# Altium project 11-10042__bug-brain__A.PrjPcb
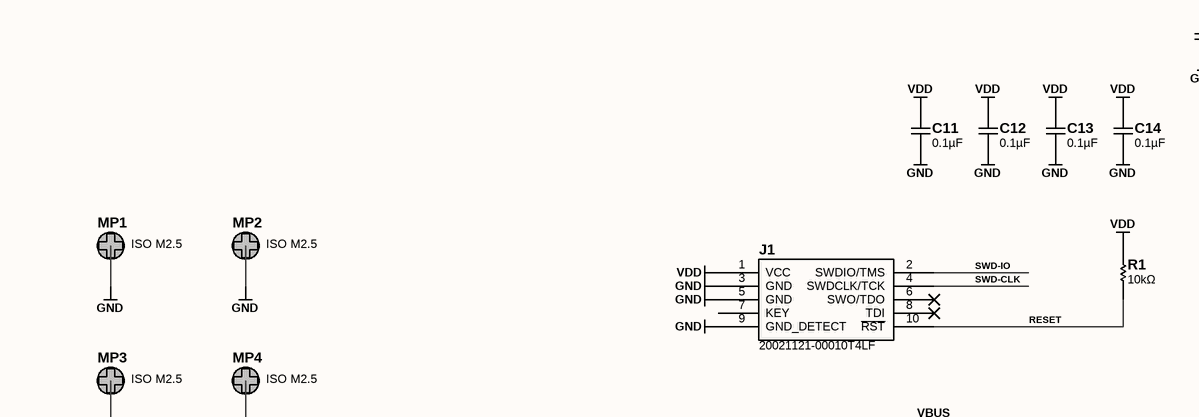
[diagram p0: bug-brain__TOP_LEVEL__A.SchDoc, top left]
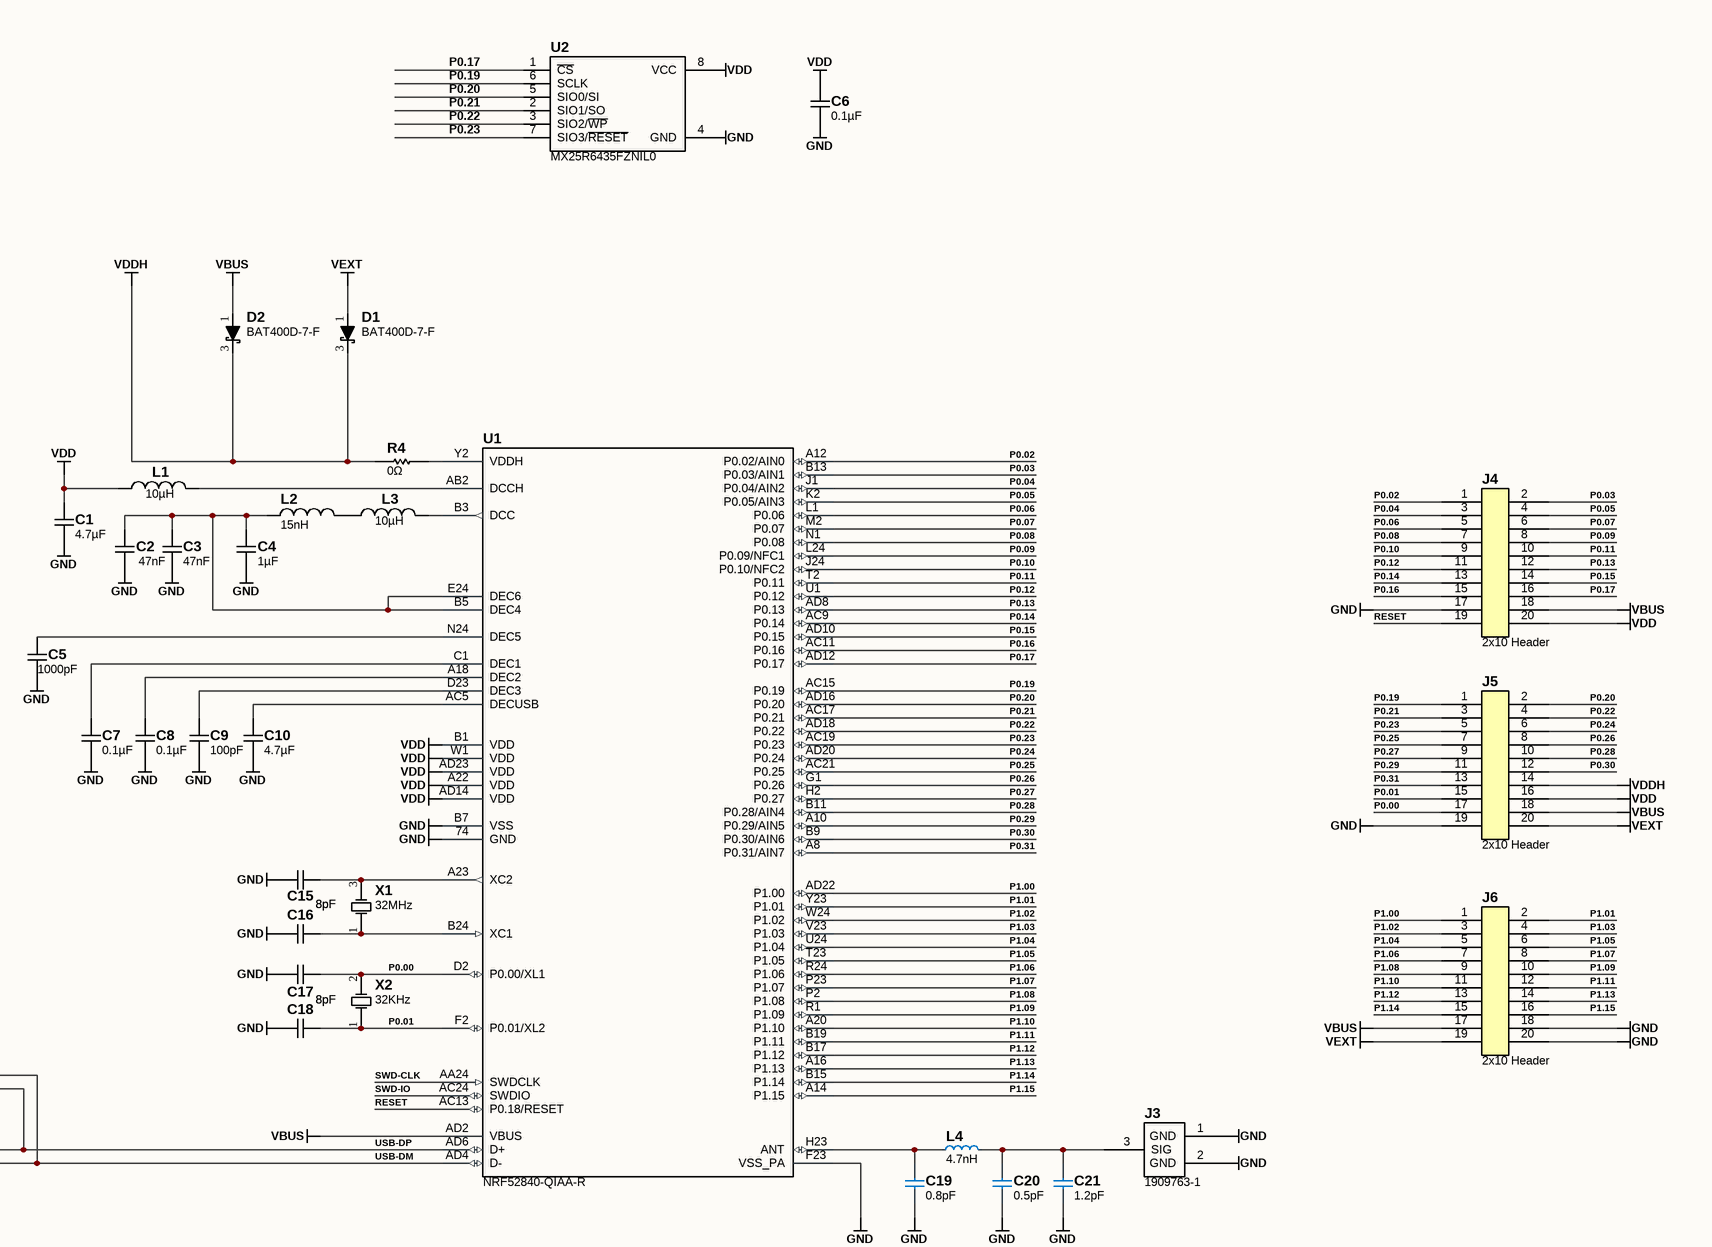
[diagram p1: bug-brain__TOP_LEVEL__A.SchDoc, top right]
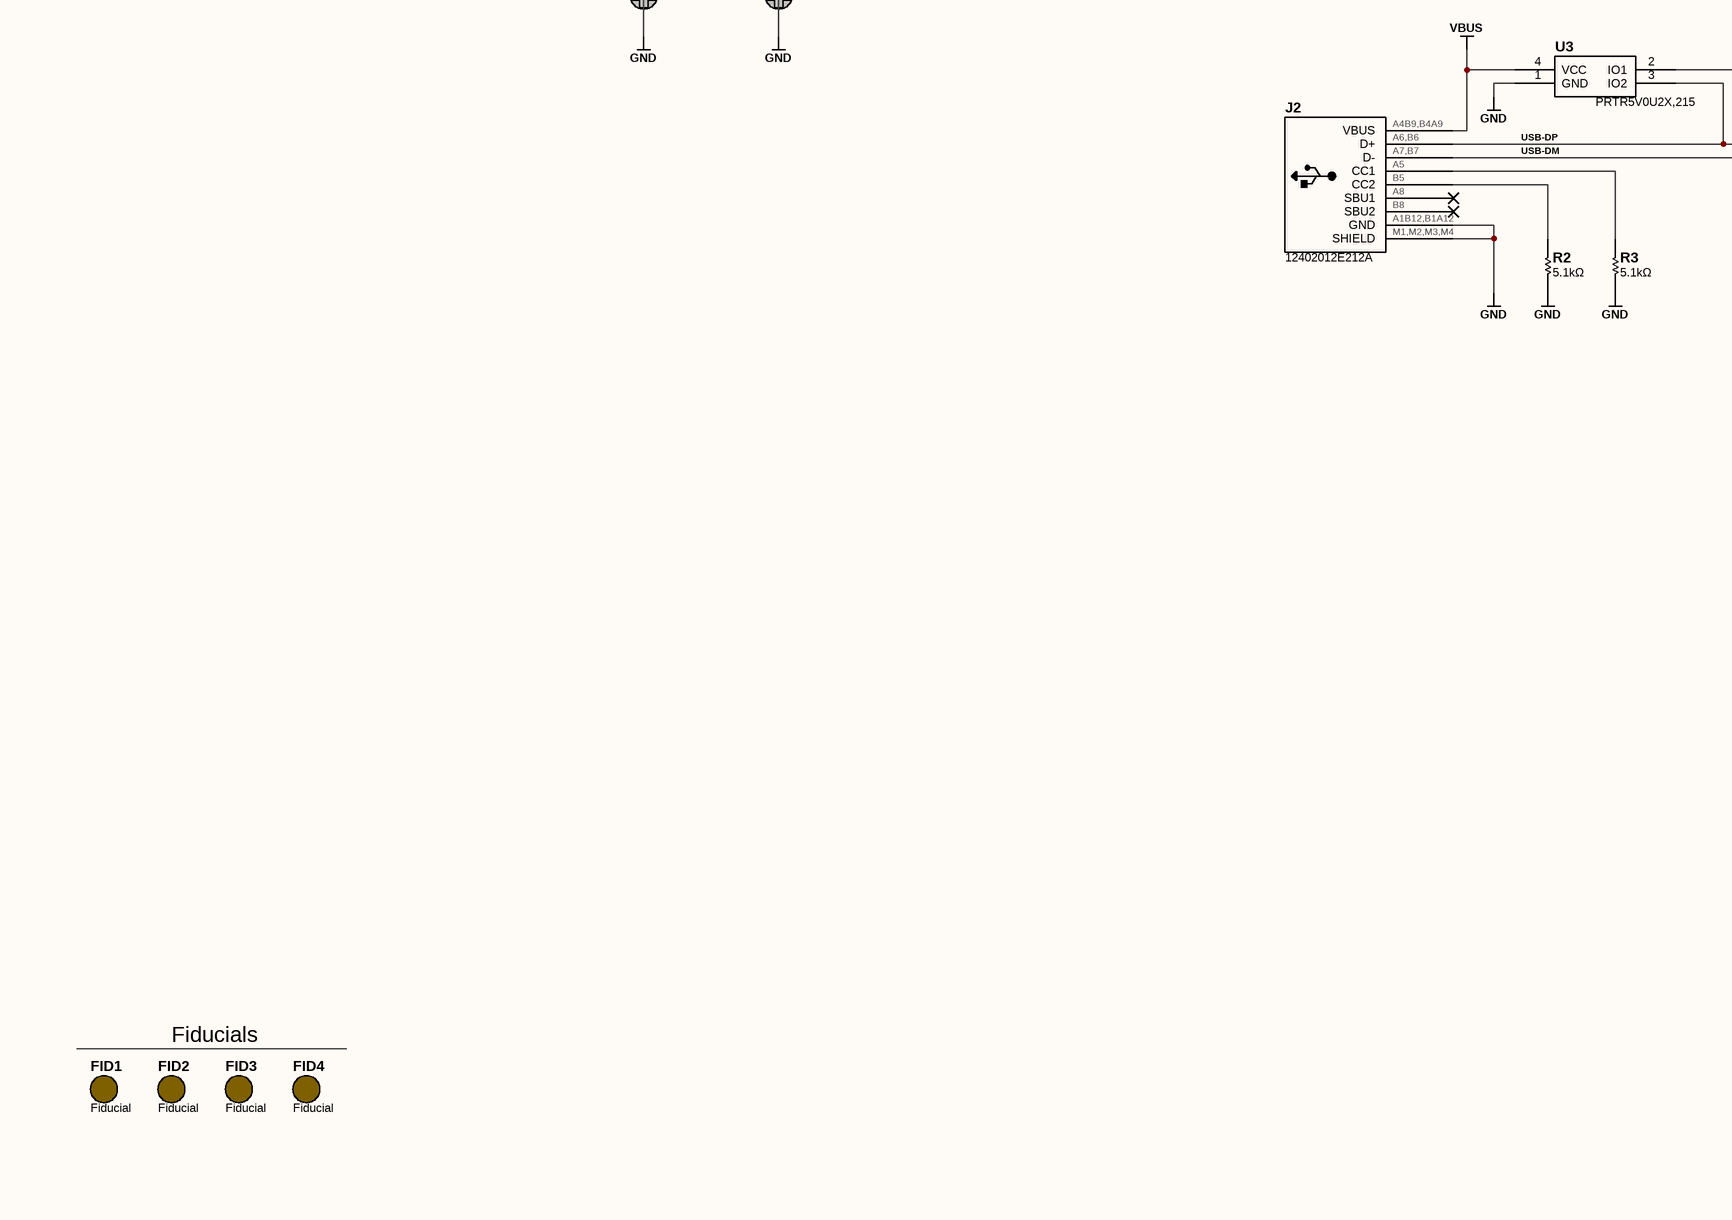
[diagram p2: bug-brain__TOP_LEVEL__A.SchDoc, bottom left]
CCA_CODENAME: bug-brain; CCA_DESCRIPTION: bug-brain; CCA_PART_NUMBER: 10-10042; CCA_TITLE: bug-brain; ENGINEER: Plexus; PCB_CODENAME: bug-brain; PCB_DATE: 2024-10-26; PCB_DESCRIPTION: bug-brain; PCB_MIXDOWN: A; PCB_PART_NUMBER: 11-10042; SCH_DATE: 2024-10-26; STATUS: PROTOTYPE
1 sheet, 50 parts. Net scope: global (net labels, ports and power ports of the same name join across sheets).
Board file: bug-brain__A.PcbDoc

## Sheet bug-brain__TOP_LEVEL__A.SchDoc
size D; Organization: Altium Limited; Address1: 3 Minna Close; Address2: Belrose; Address3: NSW 2085; Address4: Australia; SheetNumber: 1; SheetTotal: 3; PAGE_TITLE: -

### Parts
C1  4.7µF  [C0805_1.40MM_MD]
C2  47nF  [C0402_0.55MM_HD]
C3  47nF  [C0402_0.55MM_HD]
C4  1µF  [C0603_0.90MM_HD]
C5  1000pF  [C0402_0.55MM_HD]
C6  0.1µF  [C0402_0.55MM_HD]
C7  0.1µF  [C0402_0.55MM_HD]
C8  0.1µF  [C0402_0.55MM_HD]
C9  100pF  [C0402_0.55MM_HD]
C10  4.7µF  [C0805_1.40MM_MD]
C11  0.1µF  [C0402_0.55MM_HD]
C12  0.1µF  [C0402_0.55MM_HD]
C13  0.1µF  [C0402_0.55MM_HD]
C14  0.1µF  [C0402_0.55MM_HD]
C15  8pF  [C0402_0.55MM_HD]
C16  8pF  [C0402_0.55MM_HD]
C17  8pF  [C0402_0.55MM_HD]
C18  8pF  [C0402_0.55MM_HD]
C19  0.8pF  [CAPC1005X04L]
C20  0.5pF  [CAPC1005X04L]
C21  1.2pF  [CAPC1005X04L]
D1  BAT400D-7-F  [D_SOT-23-3_P]
D2  BAT400D-7-F  [D_SOT-23-3_P]
FID1  Fiducial  [fiducial-1mm-2mm]  (no BOM)
FID2  Fiducial  [fiducial-1mm-2mm]  (no BOM)
FID3  Fiducial  [fiducial-1mm-2mm]  (no BOM)
FID4  Fiducial  [fiducial-1mm-2mm]  (no BOM)
J1  20021121-00010T4LF  [FTSH-105-05-F-DV]
J2  12402012E212A  [12402012E212A]
J3  1909763-1  [1909763-1]
J4  2x10 Header  [100_2_10]
J5  2x10 Header  [100_2_10]
J6  2x10 Header  [100_2_10]
L1  10µH  [INDC1608X06L]
L2  15nH  [INDC1005X04L]
L3  10µH  [INDC1608X06L]
L4  4.7nH  [INDC1005X04L]
MP1  ISO M2.5  [M2.5]  (no BOM)
MP2  ISO M2.5  [M2.5]  (no BOM)
MP3  ISO M2.5  [M2.5]  (no BOM)
MP4  ISO M2.5  [M2.5]  (no BOM)
R1  10kΩ  [R0603_0.55MM_MD]
R2  5.1kΩ  [R0603_0.55MM_HD]
R3  5.1kΩ  [R0603_0.55MM_HD]
R4  0Ω  [R0603_0.55MM_HD]
U1  NRF52840-QIAA-R  [AQFN50P700X700X85_HS-74N]
U2  MX25R6435FZNIL0  [SON127P600X80_HS-9N]
U3  PRTR5V0U2X,215  [SOT143B]
X1  32MHz  [XTAL_2016]
X2  32KHz  [XTAL_3215]

### Nets
GND: C1.1 C2.1 C3.1 C4.1 C5.1 C6.1 C7.1 C8.1 C9.1 C10.1 C11.1 C12.1 C13.1 C14.1 C15.2 C16.2 C17.1 C18.1 C19.1 C20.1 C21.2 J1.3(GND) J1.5(GND) J1.9(GND_DETECT) J2.A1B12,B1A12(GND) J2.M1,M2,M3,M4(SHIELD) J3.1(GND) J3.2(GND) J4.17 J5.19 J6.18 J6.20 MP1.1 MP2.1 MP3.1 MP4.1 R2.1 R3.1 U1.74(GND) U1.B7(VSS) U1.F23(VSS_PA) U2.4(GND) U2.9(GND) U3.1(GND)
VBUS: D2.1(A) J2.A4B9,B4A9(VBUS) J4.18 J5.18 J6.17 U1.AD2(VBUS) U3.4(VCC)
VDD: C1.2 C6.2 C11.2 C12.2 C13.2 C14.2 J1.1(VCC) J4.20 J5.16 L1.1 R1.1 U1.A22(VDD) U1.AD14(VDD) U1.AD23(VDD) U1.B1(VDD) U1.W1(VDD) U2.8(VCC)
VDDH: D1.3(K) D2.3(K) J5.14 R4.2
VEXT: D1.1(A) J5.20 J6.19
P0.00: C17.2 J5.17 U1.D2(P0.00/XL1) X2.2(OSC2)
P0.01: C18.2 J5.15 U1.F2(P0.01/XL2) X2.1(OSC1)
P0.02: J4.1 U1.A12(P0.02/AIN0)
P0.03: J4.2 U1.B13(P0.03/AIN1)
P0.04: J4.3 U1.J1(P0.04/AIN2)
P0.05: J4.4 U1.K2(P0.05/AIN3)
P0.06: J4.5 U1.L1(P0.06)
P0.07: J4.6 U1.M2(P0.07)
P0.08: J4.7 U1.N1(P0.08)
P0.09: J4.8 U1.L24(P0.09/NFC1)
P0.10: J4.9 U1.J24(P0.10/NFC2)
P0.11: J4.10 U1.T2(P0.11)
P0.12: J4.11 U1.U1(P0.12)
P0.13: J4.12 U1.AD8(P0.13)
P0.14: J4.13 U1.AC9(P0.14)
P0.15: J4.14 U1.AD10(P0.15)
P0.16: J4.15 U1.AC11(P0.16)
P0.17: J4.16 U1.AD12(P0.17) U2.1(~{CS})
P0.19: J5.1 U1.AC15(P0.19) U2.6(SCLK)
P0.20: J5.2 U1.AD16(P0.20) U2.5(SIO0/SI)
P0.21: J5.3 U1.AC17(P0.21) U2.2(SIO1/SO)
P0.22: J5.4 U1.AD18(P0.22) U2.3(SIO2/~{WP})
P0.23: J5.5 U1.AC19(P0.23) U2.7(SIO3/~{RESET})
P0.24: J5.6 U1.AD20(P0.24)
P0.25: J5.7 U1.AC21(P0.25)
P0.26: J5.8 U1.G1(P0.26)
P0.27: J5.9 U1.H2(P0.27)
P0.28: J5.10 U1.B11(P0.28/AIN4)
P0.29: J5.11 U1.A10(P0.29/AIN5)
P0.30: J5.12 U1.B9(P0.30/AIN6)
P0.31: J5.13 U1.A8(P0.31/AIN7)
P1.00: J6.1 U1.AD22(P1.00)
P1.01: J6.2 U1.Y23(P1.01)
P1.02: J6.3 U1.W24(P1.02)
P1.03: J6.4 U1.V23(P1.03)
P1.04: J6.5 U1.U24(P1.04)
P1.05: J6.6 U1.T23(P1.05)
P1.06: J6.7 U1.R24(P1.06)
P1.07: J6.8 U1.P23(P1.07)
P1.08: J6.9 U1.P2(P1.08)
P1.09: J6.10 U1.R1(P1.09)
P1.10: J6.11 U1.A20(P1.10)
P1.11: J6.12 U1.B19(P1.11)
P1.12: J6.13 U1.B17(P1.12)
P1.13: J6.14 U1.A16(P1.13)
P1.14: J6.15 U1.B15(P1.14)
P1.15: J6.16 U1.A14(P1.15)
RESET: J1.10(~{RST}) J4.19 R1.2 U1.AC13(P0.18/RESET)
SWD-CLK: J1.4(SWDCLK/TCK) U1.AA24(SWDCLK)
SWD-IO: J1.2(SWDIO/TMS) U1.AC24(SWDIO)
USB-DM: J2.A7,B7(D-) U1.AD4(D-) U3.2(IO1)
USB-DP: J2.A6,B6(D+) U1.AD6(D+) U3.3(IO2)
NetC2_2: C2.2 C3.2 C4.2 L2.1 U1.B5(DEC4) U1.E24(DEC6)
NetC5_2: C5.2 U1.N24(DEC5)
NetC7_2: C7.2 U1.C1(DEC1)
NetC8_2: C8.2 U1.A18(DEC2)
NetC9_2: C9.2 U1.D23(DEC3)
NetC10_2: C10.2 U1.AC5(DECUSB)
NetC15_1: C15.1 U1.A23(XC2) X1.3(OSC3)
NetC16_1: C16.1 U1.B24(XC1) X1.1(OSC1)
NetC19_2: C19.2 L4.1 U1.H23(ANT)
NetC20_2: C20.2 C21.1 J3.3(SIG) L4.2
NetJ2_A5: J2.A5(CC1) R3.2
NetJ2_B5: J2.B5(CC2) R2.2
NetL1_2: L1.2 U1.AB2(DCCH)
NetL2_2: L2.2 L3.1
NetL3_2: L3.2 U1.B3(DCC)
NetR4_1: R4.1 U1.Y2(VDDH)

Not connected (* = marked no-connect by the designer): J1 6(SWO/TDO)* 7(KEY) 8(TDI)*; J2 A8(SBU1)* B8(SBU2)*

### Notes on the sheet
- Fiducials
- Part Number
- Description
- PCB Mixdown
- Date
- CCA Mixdown
- Engineer
- Page
- of

### Library data of the parts
C1 C10 = GCM21BR71C475KA73K: CAP CER 4.7UF 16V X7R 0805; Manufacturer: Murata Electronics; Tolerance: ±10%; Substitution Notes: 4.7µF , 16V , ±10% , X7R , -55°C ~ 125°C , AEC-Q200 , 0805; Value: 4.7µF; Temperature Coefficient: X7R; Manufacturer Part Number: GCM21BR71C475KA73K; Category: Capacitors; Voltage - Rated: 16V; Operating Temperature: -55°C ~ 125°C; Ratings: AEC-Q200; Package: 0805; Thickness (Max): 1.40MM; JLCPCB Part #: C2167533
C2 C3 = GCM155R71C473KA37D: CAP CER 0.047UF 16V X7R 0402; Manufacturer: Murata Electronics; Value: 0.047µF; Tolerance: ±10%; Substitution Notes: 0.047µF , 16V , ±10% , X7R , -55°C ~ 125°C , AEC-Q200 , 0402; Temperature Coefficient: X7R; Manufacturer Part Number: GCM155R71C473KA37D; Category: Capacitors; Voltage - Rated: 16V; Operating Temperature: -55°C ~ 125°C; Ratings: AEC-Q200; Package: 0402; Thickness (Max): 0.55MM; ComponentLink1Description: Datasheet (Internal); ComponentLink1URL: https://psearch.en.murata.com/capacitor/product/GCM155R71C473KA37%23.pdf; ComponentLink2Description: Datasheet (External); ComponentLink2URL: https://psearch.en.murata.com/capacitor/product/GCM155R71C473KA37%23.pdf; Supplier 1: Digikey; Supplier Part Number 1: 490-6042-1-ND; JLCPCB Part #: C126525
C4 = GCM188R71C105KA64J: CAP CER 1UF 16V X7R 0603; Manufacturer: Murata Electronics; Tolerance: ±10%; Substitution Notes: 1µF , 16V , ±10% , X7R , -55°C ~ 125°C , AEC-Q200 , 0603; Value: 1µF; Temperature Coefficient: X7R; Manufacturer Part Number: GCM188R71C105KA64J; Category: Capacitors; Voltage - Rated: 16V; Operating Temperature: -55°C ~ 125°C; Ratings: AEC-Q200; Package: 0603; Thickness (Max): 0.90MM; JLCPCB Part #: C2169902
C5 = GCM1555C1H102FA16D: CAP CER 1000PF 50V C0G/NP0 0402; Manufacturer: Murata Electronics; Temperature Coefficient: C0G, NP0; Tolerance: ±1%; Substitution Notes: 1000pF , 50V , ±1% , C0G, NP0 , -55°C ~ 125°C , AEC-Q200 , 0402; Value: 1000pF; Manufacturer Part Number: GCM1555C1H102FA16D; Category: Capacitors; Voltage - Rated: 50V; Operating Temperature: -55°C ~ 125°C; Ratings: AEC-Q200; Package: 0402; Thickness (Max): 0.55MM; ComponentLink1Description: Datasheet (Internal); ComponentLink1URL: https://search.murata.co.jp/Ceramy/image/img/A01X/G101/ENG/GCM1555C1H102FA16-01.pdf; ComponentLink2Description: Datasheet (External); ComponentLink2URL: https://search.murata.co.jp/Ceramy/image/img/A01X/G101/ENG/GCM1555C1H102FA16-01.pdf; Supplier 1: Digikey; Supplier Part Number 1: 490-16461-1-ND
C6-C8 C11-C14 = GCM155R71H104KE02D: CAP CER 0.1UF 50V X7R 0402; Manufacturer: Murata Electronics; Tolerance: ±10%; Substitution Notes: 0.1µF , 50V , ±10% , X7R , -55°C ~ 125°C , AEC-Q200 , 0402; Value: 0.1µF; Temperature Coefficient: X7R; Manufacturer Part Number: GCM155R71H104KE02D; Category: Capacitors; Voltage - Rated: 50V; Operating Temperature: -55°C ~ 125°C; Ratings: AEC-Q200; Package: 0402; Thickness (Max): 0.55MM; ComponentLink1Description: Datasheet (Internal); ComponentLink1URL: https://search.murata.co.jp/Ceramy/image/img/A01X/G101/ENG/GCM155R71H104KE02-01.pdf; ComponentLink2Description: Datasheet (External); ComponentLink2URL: https://search.murata.co.jp/Ceramy/image/img/A01X/G101/ENG/GCM155R71H104KE02-01.pdf; Supplier 1: Digikey; Supplier Part Number 1: 490-10672-1-ND; JLCPCB Part #: C85858
C9 = GCM1555C1H101FA16D: CAP CER 100PF 50V C0G/NP0 0402; Manufacturer: Murata Electronics; Temperature Coefficient: C0G, NP0; Tolerance: ±1%; Substitution Notes: 100pF , 50V , ±1% , C0G, NP0 , -55°C ~ 125°C , AEC-Q200 , 0402; Value: 100pF; Manufacturer Part Number: GCM1555C1H101FA16D; Category: Capacitors; Voltage - Rated: 50V; Operating Temperature: -55°C ~ 125°C; Ratings: AEC-Q200; Package: 0402; Thickness (Max): 0.55MM; ComponentLink1Description: Datasheet (Internal); ComponentLink1URL: https://search.murata.co.jp/Ceramy/image/img/A01X/G101/ENG/GCM1555C1H101FA16-01.pdf; ComponentLink2Description: Datasheet (External); ComponentLink2URL: https://search.murata.co.jp/Ceramy/image/img/A01X/G101/ENG/GCM1555C1H101FA16-01.pdf; Supplier 1: Digikey; Supplier Part Number 1: 490-14349-1-ND; JLCPCB Part #: C2941926
C15-C18 = GCM1555C1H8R0DA16D: CAP CER 8PF 50V C0G/NP0 0402; Manufacturer: Murata Electronics; Temperature Coefficient: C0G, NP0; Tolerance: ±0.5pF; Substitution Notes: 8pF , 50V , ±0.5pF , C0G, NP0 , -55°C ~ 125°C , AEC-Q200 , 0402; Value: 8pF; Manufacturer Part Number: GCM1555C1H8R0DA16D; Category: Capacitors; Voltage - Rated: 50V; Operating Temperature: -55°C ~ 125°C; Ratings: AEC-Q200; Package: 0402; Thickness (Max): 0.55MM; ComponentLink1Description: Datasheet (Internal); ComponentLink1URL: https://www.murata.com/~/media/webrenewal/support/library/catalog/products/capacitor/mlcc/c03e.ashx?la=en-us; ComponentLink2Description: Datasheet (External); ComponentLink2URL: https://www.murata.com/~/media/webrenewal/support/library/catalog/products/capacitor/mlcc/c03e.ashx?la=en-us; Supplier 1: Digikey; Supplier Part Number 1: 490-13294-1-ND; JLCPCB Part #: C126517
C19 = C0402-0.8p: Capacitor, NP0, ±5%; Manufacturer: Murata; Manufacturer Part Number: GJM1555C1HR80BB01D; Part number IPS: 00000007782; Part number NEMS: 100200116; Note: 50V; Artikkelnr Noca: N.A.; Pad Count: 2; Component Status: Active; Part Number: C0402-0.8p; LatestRevisionDate: 2012-11-21; Published: 2009-05-08; Value: 0.8pF; Footprint Doc: 0402; ComponentLink1URL: https://www.murata.com/~/media/webrenewal/support/library/catalog/products/capacitor/mlcc/c02e.ashx?la=en-us; ComponentLink1Description: Datasheet; ComponentLink2URL: N.A.; ComponentLink2Description: Supplier link; HelpURL: N.A.; Supplier 1: N.A.; Supplier Part Number 1: N.A.; Supplier 2: N.A.; Supplier Part Number 2: N.A.; Author: rsk; Component Class: Capacitors; PartId: 100200116; Part number Norautron: N.A.; JLCPCB Part #: C76915
C20 = C0402-0.5p: Capacitor, C0G, ±0.05pF, 50V; Manufacturer: Murata; Manufacturer Part Number: GJM1555C1HR50BB01D; Part number IPS: 00000004293; Part number NEMS: 100200112; Artikkelnr Noca: N.A.; Pad Count: 2; Component Status: Active; Part Number: C0402-0.5p; LatestRevisionDate: 2020-10-13; Published: 2009-05-08; Value: 0.5pF; Note: 50V; Footprint Doc: 0402; ComponentLink1URL: N.A.; ComponentLink1Description: Datasheet; ComponentLink2URL: N.A.; ComponentLink2Description: Supplier link; HelpURL: N.A.; Supplier 1: N.A.; Supplier Part Number 1: N.A.; Supplier 2: N.A.; Supplier Part Number 2: N.A.; Author: rsk; Component Class: Capacitors; PartId: 100200112; Part number Norautron: N.A.; JLCPCB Part #: C76911
C21 = C0402-1.2p: Capacitor, NP0, ±0.1pF; Manufacturer: Manufactrer; Manufacturer Part Number: GCQ1555C1H1R2CB01D; Part number Norautron: N.A.; Part number NEMS: 100200119; Note: 50V; Artikkelnr Noca: 20029157; Pad Count: 2; Component Status: Active; Part Number: C0402-1.2p; LatestRevisionDate: 2011-05-11; Published: 2009-05-08; Value: 1.2pF; Footprint Doc: 0402; Part number IPS: GCQ1555C1H1R2CB01D; ComponentLink1URL: N.A.; ComponentLink1Description: Datasheet; ComponentLink2URL: N.A.; ComponentLink2Description: Supplier link; HelpURL: N.A.; Supplier 1: N.A.; Supplier Part Number 1: N.A.; Supplier 2: N.A.; Supplier Part Number 2: N.A.; Author: rsk; Component Class: Capacitors; PartId: 100200119; JLCPCB Part #: C2178250
D1 D2 = BAT400D-7-F: DIODE SCHOTTKY 40V 500MA SOT23; Manufacturer: Diodes Inc; CategorySort: 400; Voltage - Forward (Vf) (Max) @ If: 550mV @ 500mA; Speed: Fast Recovery =< 500ns- > 200mA (Io); Current - Reverse Leakage @ Vr: 50µA @ 30V; Capacitance @ Vr- F: 125pF @ 0V- 1MHz; Num Pins: 3; Diode Suffix: 1A_3C; Category: Diodes; Value: BAT400D-7-F; Manufacturer Part Number: BAT400D-7-F; ComponentLink1Description: Internal Datasheet; ComponentLink1URL: http://www.diodes.com/datasheets/ds30182.pdf; ComponentLink2Description: External Datasheet; ComponentLink2URL: http://www.diodes.com/datasheets/ds30182.pdf; Supplier 1: Digi-Key; Supplier Part Number 1: BAT400D-FDICT-ND; SortValue: BAT400D-7-F; Diode Type: Schottky; Voltage - DC Reverse (Vr) (Max): 40V; Current - Average Rectified (Io): 500mA; Reverse Recovery Time (trr): -; Mounting Type: Surface Mount; Package: TO-236-3- SC-59- SOT-23-3; Supplier Device Package: SOT-23-3; Packaging: Cut Tape (CT); JLCPCB Part #: C134393
FID1-FID4 = fiducial-1mm-2mm: PCB Fiducial; Value: Fiducial; Manufacturer Part Number: fiducial-1mm-2mm; Category: misc
J1 = 20021121-00010T4LF: Connector Header Surface Mount 10 position 0.050" (1.27mm); Manufacturer: Amphenol ICC; Manufacturer Part Number: 20021121-00010T4LF; Value: 20021121-00010T4LF; JLCPCB Part #: C598540
J2 = 12402012E212A: CONN RCP USB2.0 TYP C 24P SMD RA; Manufacturer: Amphenol ICC (Commercial Products); Manufacturer Part Number: 12402012E212A; Value: 12402012E212A; JLCPCB Part #: C5150972; Category: connectors/usb
J3 = 1909763-1: CONN UMCC JACK STR 50OHM SMD; Manufacturer: TE Connectivity AMP Connectors; Connector Style: Ultra Miniature Coaxial; Connector Type: Jack, Male Pin; Contact Termination: Solder; Body Material: Copper Alloy; Body Finish: Gold; Dielectric Material: Liquid Crystal Polymer (LCP); Voltage Rating: 60V; Mating Cycles: 30; Insertion Loss: 0.24dB; Value: 1909763-1; Supplier 1: Digi-Key; Supplier Part Number 1: A118077CT-ND; Manufacturer Part Number: 1909763-1; RoHS: RoHS Compliant; Category: Connectors, Interconnects; Stock 1: 75031; Pricing 1: 1=0.49, 10=0.462, 25=0.416, 50=0.3696, 100=0.3542, 250=0.3234, 500=0.308, 1000=0.2541, 2500=0.231 (USD); Packaging: Cut Tape (CT); Part Status: Active; Shield Termination: Solder; Impedance: 50 Ohm; Mounting Type: Surface Mount; Mounting Feature: -; Cable Group: -; Fastening Type: Snap-On; Features: -; Housing Color: Ivory; Ingress Protection: -; Includes: -; Center Contact Plating: Gold; Operating Temperature: -40°C ~ 90°C; Center Contact Material: Copper Alloy; ComponentLink1URL: http://www.te.com/commerce/DocumentDelivery/DDEController?Action=srchrtrv&DocNm=1909763&DocType=Customer+Drawing&DocLang=English; ComponentLink1Description: http://www.te.com/commerce/DocumentDelivery/DDEController?Action=srchrtrv&DocNm=1909763&DocType=Customer+Drawing&DocLang=English; JLCPCB Part #: 1909763-1
J4-J6 = 100_2_10: Generic 2x10 2.54mm pitch header; Manufacturer: Wavenumber; Manufacturer 1: HCTL; Manufacturer Part Number 1: PZ254-2-10-Z-8.5; F18: 2; F19: 10; Manufacturer Part Number: 100_2_10; JLCPCB Part #: C2894971; Value: 2x10 Header
L1 L3 = L0603-10µ-TDK: Inductor, 250mA, ±20%, 1.05ohm. -55°C ~ 125°C; Manufacturer: TDK Corporation; Manufacturer Part Number: MLZ1608M100WTD25; Part number Norautron: 26521771; Part number NEMS: 100300079; Note: N.A.; Pad Count: 2; Component Status: Active; Part Number: L0603-10µ-TDK; LatestRevisionDate: 2012-09-19; Published: 2019-05-06; Value: 10µH; Footprint Doc: 0603; ComponentLink1Description: Datasheet; ComponentLink2Description: Supplier link; Artikkelnr Noca: N.A.; Part number IPS: N.A.; ComponentLink1URL: N.A.; ComponentLink2URL: N.A.; HelpURL: https://product.tdk.com/info/en/catalog/datasheets/inductor_automotive_decoupling_mlz1608_en.pdf; Supplier 1: Digi-Key; Supplier Part Number 1: 445-175588-1-ND; Supplier 2: Mouser; Supplier Part Number 2: 810-MLZ1608M100WTD25; Author: rsk; Component Class: Inductors; PartId: 100300079; JLCPCB Part #: C2047264
L2 = L0402-15n-LQG15HS15NJ02D: Inductor, 450mA, ±5%,  0.32ohm; Manufacturer: Murata; Part number NEMS: 100300412; Pad Count: 2; Note: High frequency chip inductor ±5%; Artikkelnr Noca: N.A.; Component Status: Active; Part Number: L0402-15n-LQG15HS15NJ02D; PartId: 100300412; Component Class: Inductors; Author: stl1; Manufacturer Part Number: LQG15HS15NJ02D; ComponentLink1URL: N.A.; ComponentLink1Description: Datasheet; ComponentLink2URL: N.A.; ComponentLink2Description: Supplier link; HelpURL: https://no.mouser.com/datasheet/2/281/1/JELF243B_0010-1699614.pdf; Footprint Doc: 0402; LatestRevisionDate: 2022-02-10; Published: 2022-02-10; Value: 15nH; Supplier 1: Digi-Key; Supplier Part Number 1: 490-2625-2-ND; Supplier 2: Mouser; Supplier Part Number 2: 81-LQG15HS15NJ02D; Part number IPS: N.A.; Part number Norautron: N.A.; JLCPCB Part #: C86059
L4 = L0402-4n7-LQG15HS4N7B02D: Inductor, 700mA, ±0.1nH, 160mR LQG; Manufacturer: Murata; Part number NEMS: 100300410; Pad Count: 2; Note: High frequency chip inductor ±5%; Artikkelnr Noca: N.A.; Component Status: Active; Part Number: L0402-4n7-LQG15HS4N7B02D; PartId: 100300410; Component Class: Inductors; Author: stl1; Manufacturer Part Number: LQG15HS4N7B02D; ComponentLink1URL: N.A.; ComponentLink1Description: Datasheet; ComponentLink2URL: N.A.; ComponentLink2Description: Supplier link; HelpURL: https://search.murata.co.jp/Ceramy/image/img/P02/JELF243B-0010.pdf; Footprint Doc: 0402; LatestRevisionDate: 2022-02-09; Published: 2022-02-09; Value: 4.7nH; Supplier 1: Digi-Key; Supplier Part Number 1: 490-LQG15HS4N7B02DTR-ND; Supplier 2: Mouser; Supplier Part Number 2: 81-LQG15HS4N7B02D; Part number IPS: N.A.; Part number Norautron: N.A.; JLCPCB Part #: C162543
MP1-MP4 = M2.5: M2.5 screw hole ISO standard 3.1mm clearance 8 conductivity holes 5.25mm pad size; Value: M2.5; Manufacturer Part Number: M2.5; Internal Part Number: M2.5; Manufacturer: ISO; Category: Screw Mount
R1 = ERJ-3EKF1002V: RES 10K OHM 1/10W 1% 0603 SMD; Manufacturer: Panasonic Electronic Components; Package Power: 0603  (0.1W); Power (Watts): 0.1W- 1/10W; Temperature Coefficient: ±100ppm/°C; Limiting Element Voltage: 75; Maximum Overload Voltage: 150; Maximum Working Voltage: 31.6V; Substitution Notes: 10k , ±1% , 0603 , AEC-Q200; Value: 10kΩ; Manufacturer 1: Panasonic Electronic Components; Manufacturer Part Number 1: ERJ-3EKF1002V; Category: Resistors; Resistance (Ohms): 10k; Composition: Thick Film; Features: -; Tolerance: ±1%; Package: 0603 (1608 Metric); Supplier Package: 0603; Size / Dimension: 0.063" L x 0.031" W (1.60mm x 0.80mm); Height: 0.55MM; Number of Terminations: 2; Packaging: Cut Tape (CT); Sort Value: 10000; Sort Value Package: 603_10000; Ratings: AEC-Q200; JLCPCB Part #: C191124; Manufacturer Part Number: ERJ-3EKF1002V
R2 R3 = ERJ-3EKF5101V: RES 5.1K OHM 1/10W 1% 0603 SMD; Manufacturer: Panasonic Electronic Components; Package Power: 0603  (0.1W); Power (Watts): 0.1W- 1/10W; Temperature Coefficient: ±100ppm/°C; Limiting Element Voltage: 75; Maximum Overload Voltage: 150; Maximum Working Voltage: 22.6V; Substitution Notes: 5.1k , ±1% , 0603 , AEC-Q200; Value: 5.1kΩ; Manufacturer Part Number: ERJ-3EKF5101V; ComponentLink2URL: http://industrial.panasonic.com/www-data/pdf/AOA0000/AOA0000CE2.pdf; Manufacturer 1: Panasonic Electronic Components; Manufacturer Part Number 1: ERJ-3EKF5101V; Supplier 1: Digi-Key; Supplier Part Number 1: P5.10KHCT-ND; Category: Resistors; Resistance (Ohms): 5.1k; Composition: Thick Film; Features: -; Tolerance: ±1%; Package: 0603 (1608 Metric); Supplier Package: 0603; Size / Dimension: 0.063" L x 0.031" W (1.60mm x 0.80mm); Height: 0.55MM; Number of Terminations: 2; Packaging: Cut Tape (CT); Sort Value: 5100; Sort Value Package: 603_5100; Ratings: AEC-Q200; JLCPCB Part #: C169254
R4 = ERJ-3GEY0R00V: RES 0.0 OHM 1/10W JUMP 0603 SMD; Manufacturer: Panasonic Electronic Components; Package Power: 0603  (0.1W); Resistance (Ohms): 0; Power (Watts): 0.1W- 1/10W; Tolerance: Jumper; Limiting Element Voltage: 75; Maximum Overload Voltage: 150; Maximum Working Voltage: 0.0V; Substitution Notes: 0 , Jumper , 0603 , AEC-Q200; Value: 0Ω; Manufacturer Part Number: ERJ-3GEY0R00V; JLCPCB Part #: C122704; Manufacturer 1: Panasonic Electronic Components; Manufacturer Part Number 1: ERJ-3GEY0R00V; Supplier 1: Digi-Key; Supplier Part Number 1: P0.0GCT-ND; Category: Resistors; Composition: Thick Film; Features: -; Temperature Coefficient: -; Package: 0603 (1608 Metric); Supplier Package: 0603; Size / Dimension: 0.063" L x 0.031" W (1.60mm x 0.80mm); Height: 0.55MM; Number of Terminations: 2; Sort Value: 0; Sort Value Package: 603_0; Ratings: AEC-Q200
U1 = NRF52840-QIAA-R: Cortex M4 MCU IC RF TXRX+MCU 802.15.4 73QFN; Manufacturer: Nordic; Manufacturer Part Number: NRF52840-QIAA-R; Value: NRF52840-QIAA-R; JLCPCB Part #: C190794
U2 = MX25R6435FZNIL0: Ultra low power, 64M-bit, serial multi I/O flash memory; Manufacturer: Macronix; Manufacturer Part Number: MX25R6435FZNIL0; Value: MX25R6435FZNIL0; JLCPCB Part #: C2802849
U3 = PRTR5V0U2X,215: 6V Unidirectional 5.5V SOT-143 ESD and Surge Protection (TVS/ESD) ROHS; Manufacturer: Nexperia; Manufacturer Part Number: PRTR5V0U2X,215; Value: PRTR5V0U2X,215; JLCPCB Part #: C12333
X1 = ECS-320-8-37B-CKY-TR: 32MHz 8pF ±10ppm SMD2016-4P; Manufacturer: ECS; Package Power: PACKAGE (POWER); Value: 32MHz; Manufacturer Part Number: ECS-320-8-37B-CKY-TR; JLCPCB Part #: C2636238; Category: crystals/smt
X2 = NX3215SA-32.768K-STD-MUA-9: 32.768kHz 9pF ±20ppm SMD3215-2P; Manufacturer: NDK; Package Power: PACKAGE (POWER); Value: 32KHz; Manufacturer Part Number: NX3215SA-32.768K-STD-MUA-9; JLCPCB Part #: C519280; Category: crystals/smt

## Assembly variants
A: all parts fitted